# EAGLE board light_controller (EAGLE 8.5.0)
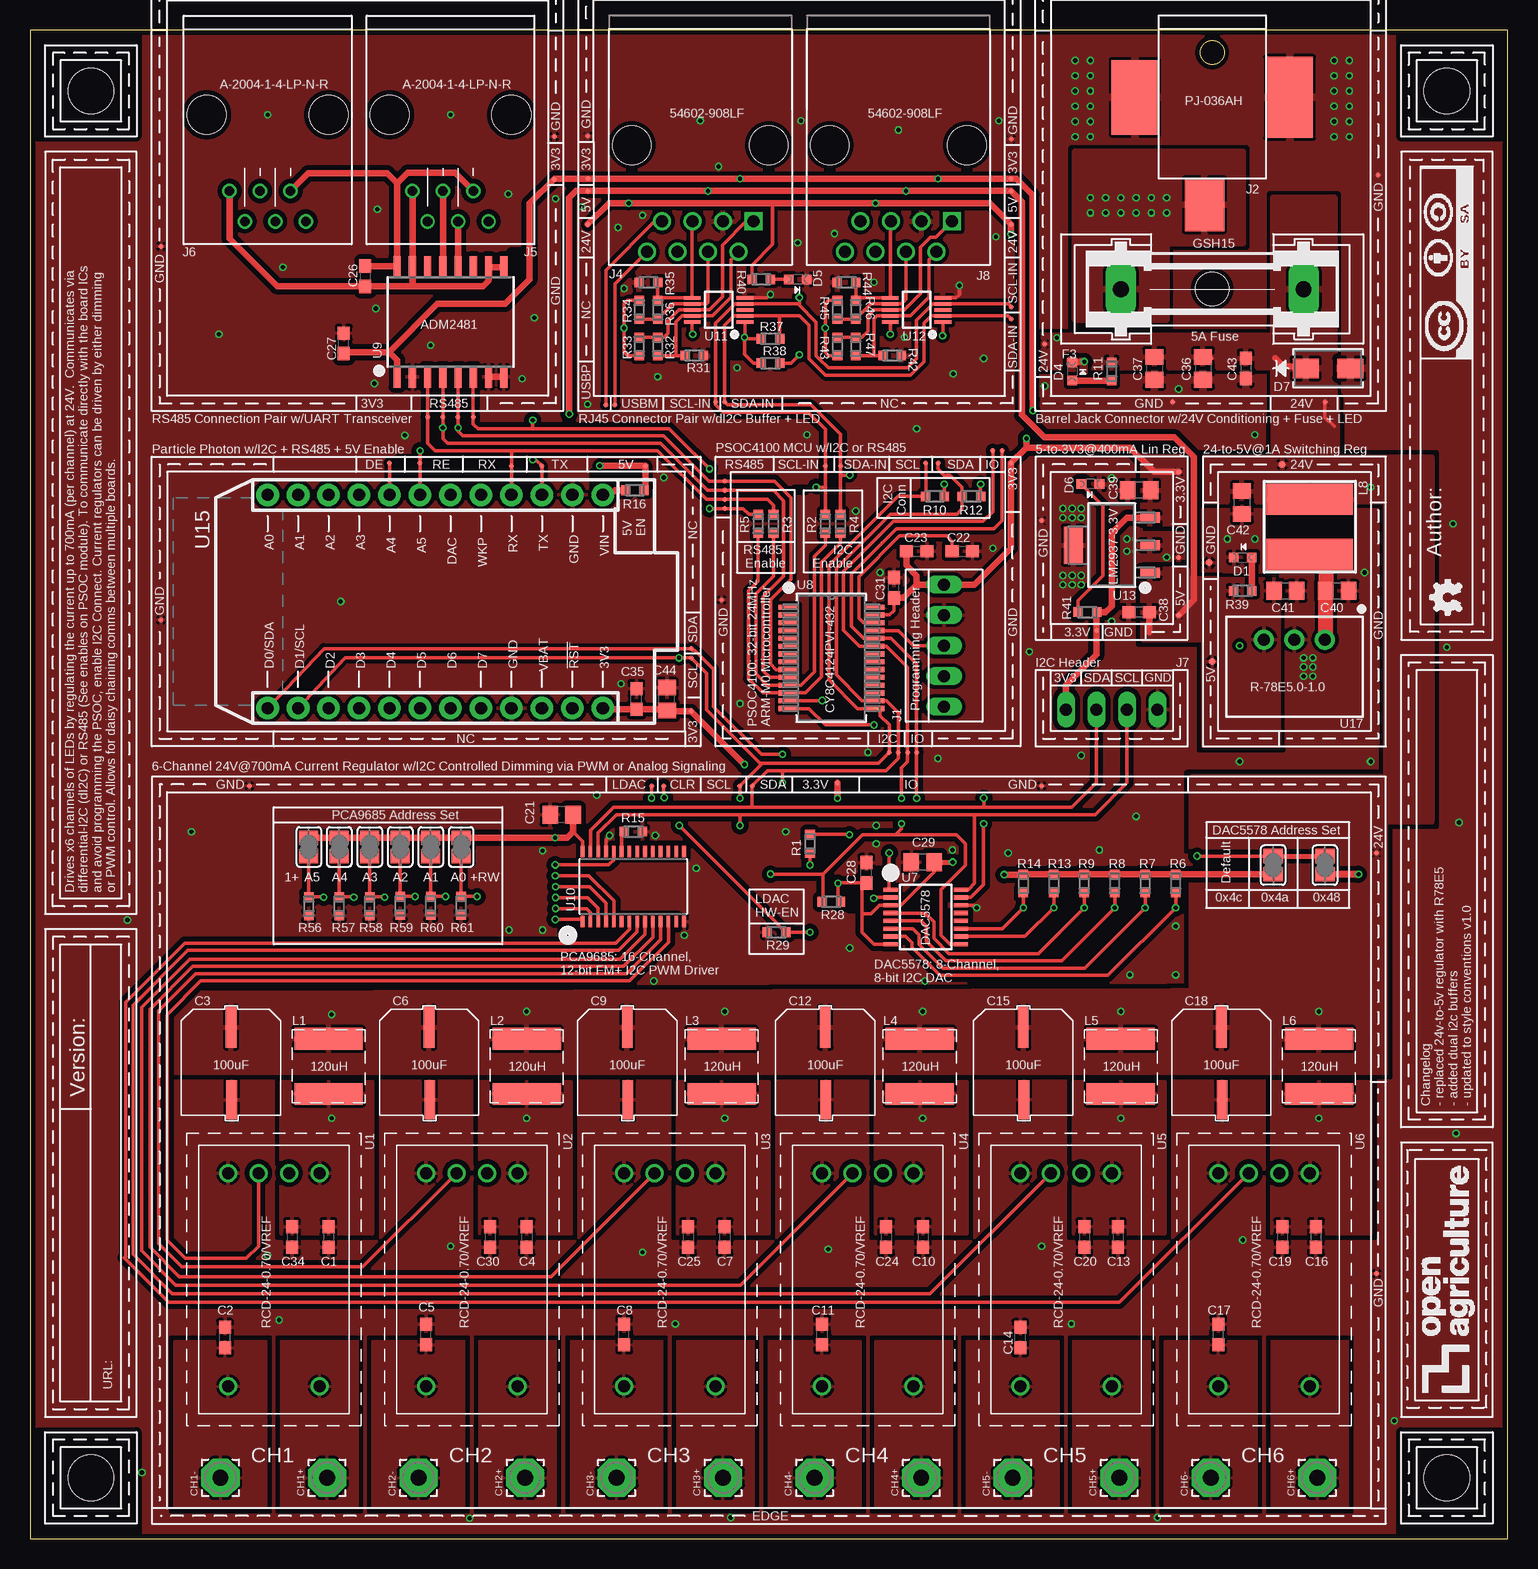
[diagram p2: board, top side]
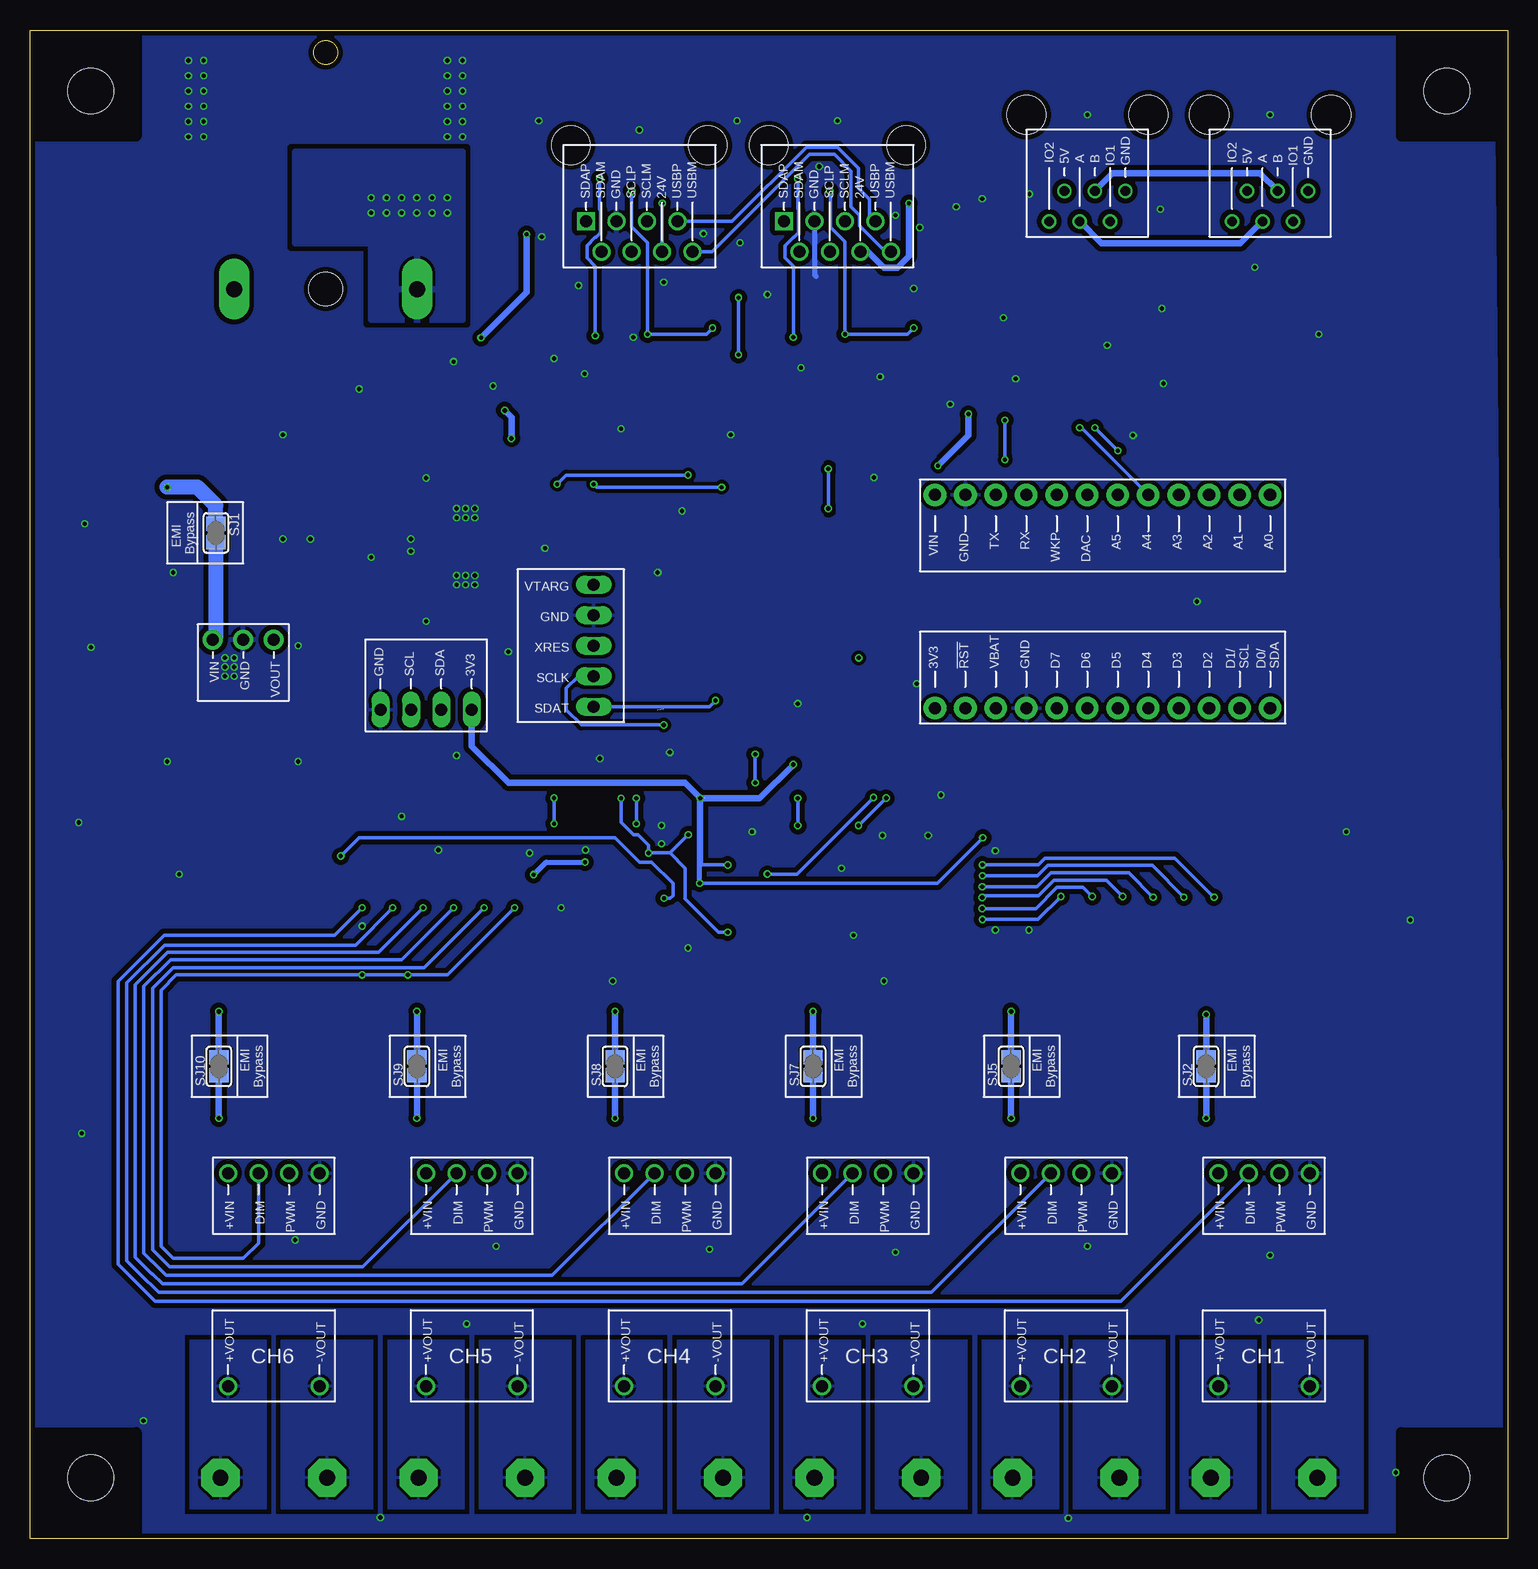
[diagram p3: board, bottom side, seen from below]

Size 123.19 x 125.73 mm. Coordinates in mm from the lower left corner, seen from the top.
Outline: 0,0 123.19,0 123.19,125.73 0,125.73 0,0
Copper layers (1*16): Top 0.035559375mm / dielectric 1.6mm / Bottom 0.035559375mm
Design rules "openag-router": minimum track width 6mil, minimum drill 10mil, track to track 12mil, track to pad 12mil, pad to pad 12mil, via to via 12mil, smd to smd 12mil, copper to edge 15mil, drill to drill 6mil, minimum pad ring 5mil, minimum via ring 5mil, stop-mask expansion 2.5mil, vias tented up to drill 20mil, thermal gap 10mil
tRestrict: 10 lines

## Footprints (pad centres in the part's own frame; a part is rotated, then mirrored left to right if it is on the bottom)
C0603 = smd 1.1 x 1: 1 -0.85,0; 2 0.85,0
EEE-1HA101UP = smd 0.889 x 3.404: + 0,-3.251 | smd 0.889 x 3.251: - -0.051,2.794
C0805 = smd 1.3 x 1.5: 1 -0.95,0; 2 0.95,0
3,17/1,3 = drill 1.321 pad 3.175 octagon: 1 0,0
CHIPLED_0603 = smd 0.8 x 0.8: A 0,-0.75; C 0,0.75
SMA = smd 2.18 x 1.63: 1 -1.857,0; 2 1.857,0
GSH15 = drill 1.321 pad 2.54 long: 1 -7.62,0; 2 7.62,0 | hole 2.794: 0,0
PSOC-PROGRAMMER-22-23-2051 = drill 1 long: 1 -5.08,0; 2 -2.54,0; 3 0,0; 4 2.54,0; 5 5.08,0
BARREL-JACK-PJ-036AH = smd 4.4 x 3.3: 1 2.2,-0.65 | smd 6.75 x 3.9: 2 -6.75,6.45 | smd 6.2 x 3.9: 3 -6.75,-6.45
RJ45-DI2C-USB-54602-908LF = drill 1: 24V(6) 1.905,8.89; DSCLM(5) 0.635,6.35; DSCLP(4) -0.635,8.89; DSDAM(2) -3.175,8.89; GND(3) -1.905,6.35; USBM(8) 4.445,8.89; USBP(7) 3.175,6.35 | drill 1 square: DSDAP(1) -4.445,6.35 | hole 3.2: -5.715,0; 5.715,0
RJ12-RS485--A-2004-1-4-LP-N-R = drill 0.8: 1 -8.89,-3.175; 2 -6.35,-1.905; 3 -8.89,-0.635; 4 -6.35,0.635; 5 -8.89,1.905; 6 -6.35,3.175 | hole 3.25: 0,-5.08; 0,5.08
HEADER-I2C = drill 1 long: 3V3 3.81,0.762; GND -3.81,0.762; SCL -1.27,0.762; SDA 1.27,0.762
74404064121 = smd 1.8 x 5.7: 1 -2.3,0; 2 2.3,0
29333C = smd 2.6 x 7.2: 1 -2.3,0; 2 2.3,0
RC0603N = smd 0.756 x 0.8: 1 -0.778,0; 2 0.778,0
EMI-BYPASS = smd 1.168 x 1.6: 1 -0.762,0.254; 2 0.762,0.254
SJ1 = smd 1.168 x 1.6: 1 -0.762,0; 2 0.762,0
TP04R = smd 0.4 x 0.4: 1 0,0
TP06R = smd 0.6 x 0.6: TP 0,0
RCD-24-PINNED = drill 1: 1 0,0; 2 0,-2.54; 3 0,-5.08; 4 0,-7.62; 5 17.78,-7.62; 6 17.78,0
TSSOP16 = smd 0.35 x 1.2: 1 -2.275,-2.925; 2 -1.625,-2.925; 3 -0.975,-2.925; 4 -0.325,-2.925; 5 0.325,-2.925; 6 0.975,-2.925; 7 1.625,-2.925; 8 2.275,-2.925; 9 2.275,2.925; 10 1.625,2.925; 11 0.975,2.925; 12 0.325,2.925; 13 -0.325,2.925; 14 -0.975,2.925; 15 -1.625,2.925; 16 -2.275,2.925
SSOP-28 = smd 1.651 x 0.432: 1 -3.581,4.225; 2 -3.581,3.575; 3 -3.581,2.925; 4 -3.581,2.275; 5 -3.581,1.625; 6 -3.581,0.975; 7 -3.581,0.325; 8 -3.581,-0.325; 9 -3.581,-0.975; 10 -3.581,-1.625; 11 -3.581,-2.275; 12 -3.581,-2.925; 13 -3.581,-3.575; 14 -3.581,-4.225; 15 3.581,-4.225; 16 3.581,-3.575; 17 3.581,-2.925; 18 3.581,-2.275; 19 3.581,-1.625; 20 3.581,-0.975; 21 3.581,-0.325; 22 3.581,0.325; 23 3.581,0.975; 24 3.581,1.625; 25 3.581,2.275; 26 3.581,2.925; 27 3.581,3.575; 28 3.581,4.225
SOIC16LWB = smd 0.6 x 1.8: 1 -4.445,-4.575; 2 -3.175,-4.575; 3 -1.905,-4.575; 4 -0.635,-4.575; 5 0.635,-4.575; 6 1.905,-4.575; 7 3.175,-4.575; 8 4.445,-4.575; 9 4.445,4.575; 10 3.175,4.575; 11 1.905,4.575; 12 0.635,4.575; 13 -0.635,4.575; 14 -1.905,4.575; 15 -3.175,4.575; 16 -4.445,4.575
TSSOP28 = smd 0.305 x 0.991: 1 -4.225,-2.918; 2 -3.575,-2.918; 3 -2.925,-2.918; 4 -2.275,-2.918; 5 -1.625,-2.918; 6 -0.975,-2.918; 7 -0.325,-2.918; 8 0.325,-2.918; 9 0.975,-2.918; 10 1.625,-2.918; 11 2.275,-2.918; 12 2.925,-2.918; 13 3.575,-2.918; 14 4.225,-2.918; 15 4.225,2.918; 16 3.575,2.918; 17 2.925,2.918; 18 2.275,2.918; 19 1.625,2.918; 20 0.975,2.918; 21 0.325,2.918; 22 -0.325,2.918; 23 -0.975,2.918; 24 -1.625,2.918; 25 -2.275,2.918; 26 -2.925,2.918; 27 -3.575,2.918; 28 -4.225,2.918
SOP50P490X110-10N = smd 1.4 x 0.3: 1 -2.2,1; 2 -2.2,0.5; 3 -2.2,0; 4 -2.2,-0.5; 5 -2.2,-1; 6 2.2,-1; 7 2.2,-0.5; 8 2.2,0; 9 2.2,0.5; 10 2.2,1
MP04A = smd 1.6 x 0.838: 1 -3.2,2.3; 2 -3.2,0; 3 -3.2,-2.3 | smd 1.6 x 3.099: 4 3.2,0
PHOTON = drill 1.016 pad 1.88: 1 1.27,32.258; 2 1.27,29.718; 3 1.27,27.178; 4 1.27,24.638; 5 1.27,22.098; 6 1.27,19.558; 7 1.27,17.018; 8 1.27,14.478; 9 1.27,11.938; 10 1.27,9.398; 11 1.27,6.858; 12 1.27,4.318; 13 19.05,4.318; 14 19.05,6.858; 15 19.05,9.398; 16 19.05,11.938; 17 19.05,14.478; 18 19.05,17.018; 19 19.05,19.558; 20 19.05,22.098; 21 19.05,24.638; 22 19.05,27.178; 23 19.05,29.718; 24 19.05,32.258
R-78E5.0-1.0 = drill 1 pad 1.676: 1 -2.54,0; 2 0,0; 3 2.54,0
CORNER = hole 3.81: 0,0

## Placement (x,y rotation side)
C1  10nF  [C0603]  24.89,25.15 270 top
C2  10nF  [C0603]  16.26,16.76 90 top
C3  100uF  [EEE-1HA101UP]  16.76,39.37 180 top
C4  10nF  [C0603]  41.4,25.15 270 top
C5  10nF  [C0603]  33.02,17.02 90 top
C6  100uF  [EEE-1HA101UP]  33.27,39.37 180 top
C7  10nF  [C0603]  57.91,25.15 270 top
C8  10nF  [C0603]  49.53,17.02 90 top
C9  100uF  [EEE-1HA101UP]  49.78,39.37 180 top
C10  10nF  [C0603]  74.42,25.15 270 top
C11  10nF  [C0603]  66.04,17.02 90 top
C12  100uF  [EEE-1HA101UP]  66.29,39.37 180 top
C13  10nF  [C0603]  90.68,25.15 270 top
C14  10nF  [C0603]  82.55,16.76 90 top
C15  100uF  [EEE-1HA101UP]  82.8,39.37 180 top
C16  10nF  [C0603]  107.19,25.15 270 top
C17  10nF  [C0603]  99.06,17.02 90 top
C18  100uF  [EEE-1HA101UP]  99.31,39.37 180 top
C19  2.2uF  [C0603]  104.39,25.15 270 top
C20  2.2uF  [C0603]  87.88,25.15 270 top
C21  10uF  [C0805]  44.32,60.33 180 top
C22  1uF  [C0603]  77.72,82.3 0 top
C23  1uF  [C0603]  73.91,82.3 0 top
C24  2.2uF  [C0603]  71.37,25.15 270 top
C25  2.2uF  [C0603]  54.86,25.15 270 top
C26  0.1uF  [C0603]  27.94,105.21 270 top
C27  0.1uF  [C0603]  26.16,99.62 90 top
C28  0.1uF  [C0603]  69.72,55.5 90 top
C29  4.7uF  [C0805]  74.42,56.39 180 top
C30  2.2uF  [C0603]  38.35,25.15 270 top
C31  0.1uF  [C0603]  72.01,79.25 90 top
C34  2.2uF  [C0603]  21.84,25.15 270 top
C35  0.1uF  [C0603]  50.55,69.98 90 top
C36  10uF  [C0805]  97.79,97.54 270 top
C37  4.7uF  [C0805]  93.73,97.54 270 top
C38  0.1uF  [C0603]  92.46,77.22 180 top
C39  10uF  [C0805]  92.46,87.38 180 top
C40  10uF  [C0805]  108.97,78.99 0 top
C41  10uF  [C0805]  104.65,78.99 0 top
C42  10uF  [C0805]  101.03,86.36 270 top
C43  0.1uF  [C0603]  101.35,97.54 270 top
C44  4.7uF  [C0805]  53.09,69.98 90 top
CH1+  [3,17/1,3]  24.77,5.08 90 top
CH1-  [3,17/1,3]  15.88,5.08 90 top
CH2+  [3,17/1,3]  41.27,5.08 90 top
CH2-  [3,17/1,3]  32.38,5.08 90 top
CH3+  [3,17/1,3]  57.78,5.08 90 top
CH3-  [3,17/1,3]  48.9,5.08 90 top
CH4+  [3,17/1,3]  74.3,5.08 90 top
CH4-  [3,17/1,3]  65.41,5.08 90 top
CH5+  [3,17/1,3]  90.81,5.08 90 top
CH5-  [3,17/1,3]  81.92,5.08 90 top
CH6+  [3,17/1,3]  107.31,5.08 90 top
CH6-  [3,17/1,3]  98.42,5.08 90 top
D1  APT1608  [CHIPLED_0603]  101.09,81.79 90 top
D4  APT1608  [CHIPLED_0603]  86.87,97.28 0 top
D5  APT1608  [CHIPLED_0603]  64.01,104.95 270 top
D6  APT1608  [CHIPLED_0603]  88.39,87.88 270 top
D7  SMAJ26A  [SMA]  108.2,97.54 0 top
F3  GSH15  [GSH15]  98.55,104.14 0 top
J1  0022232051  [PSOC-PROGRAMMER-22-23-2051]  76.2,74.42 90 top
J2  PJ-036AH  [BARREL-JACK-PJ-036AH]  98.55,113.36 270 top
J4  54602-908LF  [RJ45-DI2C-USB-54602-908LF]  55.88,116.13 180 top
J5  A-2004-1-4-LP-N-R  [RJ12-RS485--A-2004-1-4-LP-N-R]  35.05,118.67 90 top
J6  A-2004-1-4-LP-N-R  [RJ12-RS485--A-2004-1-4-LP-N-R]  19.81,118.67 90 top
J7  I2C-HEADER  [HEADER-I2C]  90.17,69.85 180 top
J8  54602-908LF  [RJ45-DI2C-USB-54602-908LF]  72.39,116.13 180 top
L1  120uH  [74404064121]  24.89,39.37 270 top
L2  120uH  [74404064121]  41.4,39.37 270 top
L3  120uH  [74404064121]  57.66,39.37 270 top
L4  120uH  [74404064121]  74.17,39.37 270 top
L5  120uH  [74404064121]  90.93,39.37 270 top
L6  120uH  [74404064121]  107.44,39.37 270 top
L8  33uH  [29333C]  106.68,84.33 270 top
R1  1K  [RC0603N]  65.02,57.91 90 top
R2  0 OHM  [RC0603N]  66.29,84.58 90 top
R3  0 OHM  [RC0603N]  61.98,84.58 90 top
R4  0 OHM  [RC0603N]  67.56,84.58 90 top
R5  0 OHM  [RC0603N]  60.71,84.58 90 top
R6  1K  [RC0603N]  95.5,54.61 90 top
R7  1K  [RC0603N]  92.96,54.61 90 top
R8  1K  [RC0603N]  90.42,54.61 90 top
R9  1K  [RC0603N]  87.88,54.61 90 top
R10  0 OHM  [RC0603N]  75.44,86.87 180 top
R11  100  [RC0603N]  90.17,97.28 90 top
R12  0 OHM  [RC0603N]  78.49,86.87 180 top
R13  1K  [RC0603N]  85.34,54.61 90 top
R14  1K  [RC0603N]  82.8,54.61 90 top
R15  1K  [RC0603N]  50.29,58.93 0 top
R16  0 OHM  [RC0603N]  50.42,87.38 180 top
R28  1K  [RC0603N]  66.8,53.09 180 top
R29  0 OHM  [RC0603N]  62.23,50.55 0 top
R31  600  [RC0603N]  55.37,98.6 0 top
R32  120  [RC0603N]  52.32,99.36 270 top
R33  600  [RC0603N]  50.8,99.36 90 top
R34  600  [RC0603N]  50.8,102.41 90 top
R35  600  [RC0603N]  51.56,104.7 0 top
R36  120  [RC0603N]  52.32,102.41 270 top
R37  10K  [RC0603N]  61.72,100 180 top
R38  10K  [RC0603N]  61.72,97.97 180 top
R39  100  [RC0603N]  101.09,78.99 180 top
R40  1K  [RC0603N]  60.96,104.95 180 top
R41  100  [RC0603N]  88.14,77.22 0 top
R42  600  [RC0603N]  71.88,98.6 0 top
R43  600  [RC0603N]  67.31,99.36 90 top
R44  600  [RC0603N]  68.07,104.7 0 top
R45  600  [RC0603N]  67.31,102.41 90 top
R46  120  [RC0603N]  68.83,102.41 270 top
R47  120  [RC0603N]  68.83,99.36 270 top
R56  1K  [RC0603N]  23.24,52.71 90 top
R57  1K  [RC0603N]  25.78,52.71 90 top
R58  1K  [RC0603N]  28.32,52.71 90 top
R59  1K  [RC0603N]  30.86,52.75 90 top
R60  1K  [RC0603N]  33.4,52.75 90 top
R61  1K  [RC0603N]  35.94,52.75 90 top
SJ1  [EMI-BYPASS]  107.95,83.82 270 bottom
SJ2  [EMI-BYPASS]  24.89,39.37 90 bottom
SJ5  [EMI-BYPASS]  41.15,39.37 90 bottom
SJ7  [EMI-BYPASS]  57.66,39.37 90 bottom
SJ8  [EMI-BYPASS]  74.17,39.37 90 bottom
SJ9  [EMI-BYPASS]  90.68,39.37 90 bottom
SJ10  [EMI-BYPASS]  107.19,39.37 90 bottom
SJ_A0  [SJ1]  35.94,57.65 270 top
SJ_A1  [SJ1]  33.4,57.65 270 top
SJ_A2  [SJ1]  30.86,57.65 270 top
SJ_A3  [SJ1]  28.32,57.65 270 top
SJ_A4  [SJ1]  25.78,57.65 270 top
SJ_A5  [SJ1]  23.24,57.65 270 top
SJ_A16  [SJ1]  103.63,56.13 90 top
SJ_A17  [SJ1]  107.95,56.13 90 top
TP1  TPTP04R  [TP04R]  107.95,94.74 0 top
TP2  TPTP04R  [TP04R]  95.25,94.74 0 top
TP3  TPTP04R  [TP04R]  32.51,89.66 0 top
TP4  TPTP04R  [TP04R]  29.97,89.66 0 top
TP5  TPTP04R  [TP04R]  72.39,65.53 90 top
TP6  TPTP04R  [TP04R]  71.63,65.53 90 top
TP7  TPTP04R  [TP04R]  10.92,107.7 0 top
TP8  TPTP04R  [TP04R]  81.03,90.68 90 top
TP9  TPTP04R  [TP04R]  57.66,78.23 90 top
TP10  TPTP04R  [TP04R]  43.69,116.84 0 top
TP11  TPTP04R  [TP04R]  57.91,85.85 90 top
TP12  TPTP04R  [TP04R]  112.27,57.15 90 top
TP13  TPTP04R  [TP04R]  67.31,62.99 90 top
TP14  TPTP04R  [TP04R]  18.29,62.74 90 top
TP15  TPTP04R  [TP04R]  60.2,62.74 90 top
TP16  TPTP04R  [TP04R]  59.18,62.74 90 top
TP17  TPTP04R  [TP04R]  51.82,62.74 90 top
TP18  TPTP04R  [TP04R]  75.69,89.66 90 top
TP19  TPTP04R  [TP04R]  81.79,89.66 90 top
TP20  TPTP04R  [TP04R]  57.91,86.61 90 top
TP21  TPTP04R  [TP04R]  57.91,87.38 90 top
TP22  TPTP04R  [TP04R]  57.91,88.14 90 top
TP23  TPTP04R  [TP04R]  80.26,90.68 90 top
TP24  TPTP04R  [TP04R]  74.68,89.66 90 top
TP25  TPTP04R  [TP04R]  67.56,89.41 90 top
TP26  TPTP04R  [TP04R]  66.29,89.41 90 top
TP27  TPTP04R  [TP04R]  43.69,113.28 0 top
TP28  TPTP04R  [TP04R]  36.96,93.47 270 top
TP29  TPTP04R  [TP04R]  33.15,93.47 270 top
TP30  TPTP04R  [TP04R]  34.42,93.47 270 top
TP31  TPTP04R  [TP04R]  35.69,93.47 270 top
TP32  TPTP04R  [TP04R]  52.83,62.74 90 top
TP33  TPTP04R  [TP04R]  84.33,62.74 0 top
TP34  TPTP04R  [TP04R]  112.27,22.1 0 top
TP35  TPTP04R  [TP04R]  112.39,113.67 0 top
TP36  TPTP04R  [TP04R]  84.58,99.57 0 top
TP37  TPTP04R  [TP04R]  73.15,65.53 90 top
TP38  TPTP04R  [TP04R]  73.91,65.53 90 top
TP40  TPTP04R  [TP04R]  46.48,113.33 270 top
TP41  TPTP04R  [TP04R]  46.48,112.32 270 top
TP42  TPTP04R  [TP04R]  46.48,116.89 270 top
TP43  TPTP04R  [TP04R]  46.48,109.52 270 top
TP44  TPTP04R  [TP04R]  57.91,94.74 270 top
TP45  TPTP04R  [TP04R]  57.15,94.74 270 top
TP46  TPTP04R  [TP04R]  48.01,94.49 270 top
TP47  TPTP04R  [TP04R]  48.77,94.49 270 top
TP48  TPTP04R  [TP04R]  81.79,113.33 270 top
TP49  TPTP04R  [TP04R]  81.79,112.32 270 top
TP50  TPTP04R  [TP04R]  81.79,109.52 270 top
TP51  TPTP04R  [TP04R]  81.79,116.64 270 top
TP52  TPTP04R  [TP04R]  81.79,102.67 270 top
TP53  TPTP04R  [TP04R]  81.79,101.65 270 top
TP54  TPTP06R  [TP06R]  98.55,73.09 180 top
TP55  TPTP06R  [TP06R]  104.39,89.53 180 top
TP56  TPTP06R  [TP06R]  98.3,81.34 180 top
TP57  TPTP04R  [TP04R]  88.9,75.69 90 top
TP58  TPTP04R  [TP04R]  95.76,76.96 90 top
TP59  TPTP04R  [TP04R]  84.33,84.84 90 top
TP60  TPTP04R  [TP04R]  95.76,88.9 90 top
TP61  TPTP04R  [TP04R]  95.76,81.79 90 top
TP66  TPTP04R  [TP04R]  55.12,73.41 180 top
TP67  TPTP04R  [TP04R]  55.12,68.96 180 top
TP68  TPTP04R  [TP04R]  10.92,76.58 180 top
TP69  TPTP04R  [TP04R]  55.12,74.17 180 top
TP70  TPTP04R  [TP04R]  51.31,89.41 0 top
TP71  TPTP04R  [TP04R]  42.67,89.41 0 top
TP72  TPTP04R  [TP04R]  40.13,89.41 0 top
U1  RCD-24-0.70/VREF  [RCD-24-PINNED]  24.13,30.48 270 top
U2  RCD-24-0.70/VREF  [RCD-24-PINNED]  40.64,30.48 270 top
U3  RCD-24-0.70/VREF  [RCD-24-PINNED]  57.15,30.48 270 top
U4  RCD-24-0.70/VREF  [RCD-24-PINNED]  73.66,30.48 270 top
U5  RCD-24-0.70/VREF  [RCD-24-PINNED]  90.17,30.48 270 top
U6  RCD-24-0.70/VREF  [RCD-24-PINNED]  106.68,30.48 270 top
U7  DAC5578  [TSSOP16]  74.68,51.82 270 top
U8  CY8C4124PVI-432  [SSOP-28]  66.8,73.41 0 top
U9  ADM2481  [SOIC16LWB]  35.05,101.4 0 top
U10  PCA9685  [TSSOP28]  50.29,54.36 0 top
U11  PCA9615  [SOP50P490X110-10N]  57.4,102.41 180 top
U12  PCA9615  [SOP50P490X110-10N]  73.91,102.41 180 top
U13  LM2937-3.3V  [MP04A]  90.17,82.8 180 top
U15  PHOTONH  [PHOTON]  15.49,88.27 270 top
U17  R-78E5.0-1.0  [R-78E5.0-1.0]  105.41,74.93 180 top
U$1  [CORNER]  5.08,5.08 0 top
U$2  [CORNER]  118.11,5.08 90 top
U$3  [CORNER]  5.08,120.65 270 top
U$4  [CORNER]  118.11,120.65 180 top
U$6  AUTHOR  [AUTHOR]  121.92,74.93 90 top
U$7  TITLE  [TITLE]  8.89,10.16 90 top
U$8  [LOGO]  121.92,10.16 90 top

## Tracks (layer width: path | path; a pad name or v marks a point on that pad's centre or on a via)
24V_EMI
  Top 1.27: U17.1 108.02,75 C40.1 108.02,80.69 arc90 L8.2
  Bottom 1.27: SJ1.2 107.7,75.18 U17.1
24V_IN  (via drill 0.35)
  other vias: 94.74,111.76 94.74,110.49 93.47,111.76 93.47,110.49 92.2,111.76 92.2,110.49 90.93,111.76 89.66,111.76 89.66,110.49 90.93,110.49 88.39,110.49 88.39,111.76
  pour Bottom (isolate 0.406): 94.74,101.6 87.12,101.6 87.12,115.57 101.09,115.57 101.09,107.95 94.74,107.95
  pour Top (isolate 0.406): 87.12,101.6 94.74,101.6 94.74,107.95 101.09,107.95 101.09,115.57 87.12,115.57
485_5V
  Top 0.559: J5.2 35.43,113.84 31.5,113.84 30.61,112.95 | 30.61,112.95 U9.16 30.52,106.06 C26.1 | 30.61,112.95 29.77,113.79 23.19,113.79 J6.2
485_A
  Top 0.559: U9.12 J5.3
  Bottom 0.559: J5.3 33.86,107.95 22.28,107.95 J6.3
485_B
  Top 0.305: 34.54,112.19 J5.4
  Top 0.559: U9.13 J5.4
  Bottom 0.559: J5.4 32.94,113.79 20.65,113.79 J6.4
485_GND
  Top 0.559: U9.9 U9.10 38.23,104.83 37.76,104.36 31.75,104.36 | 31.75,104.36 31.88,104.48 U9.15 J5.6 | 28.07,104.48 C26.2 | C26.2 31.75,104.36 | C26.2 20.61,104.36 16.64,108.33 J6.6
!LDAC!  (via drill 0.35)
  Top 0.305: v71.63,57.15 71.62,56.38 71.62,54.22 U7.1 | 62.39,51.16 62.39,51.18 62.37,51.2 | 62.37,51.2 v54.13,59.44 | 68.91,80.85 | v68.32,58.68 v68.31,58.69 R1.2 | v51.82,61.72 TP17.1 | 62.37,51.2 62.37,51.18 R29.2 v65.02,50.55 | 68.91,80.85 68.48,80.42 68.48,76.03 69.47,75.03 U8.24 71.78,75.03 73.91,72.9 TP38.1 73.86,65.48 73.91,65.43 v73.91,61.72 73.86,61.77 | 71.04,82.98 | 68.91,80.85 71.04,82.98 | 71.04,82.98 72.24,84.18 80.37,84.18 81.03,84.84 TP8.1
  Bottom 0.305: v65.02,50.55 65.79,50.55 68.58,53.34 68.58,55.88 69.85,57.15 | v68.32,58.68 69.85,57.15 | 69.85,57.15 v71.63,57.15 71.63,57.79 72.51,58.67 72.89,58.67 73.91,59.69 v73.91,61.72 | v54.13,59.44 51.84,61.72 v51.82,61.72
+3V3  (via drill 0.35)
  Top 0.305: v67.36,54.63 67.36,53.3 R28.1 | R1.1 v65.02,56.15 | 69.34,52.07 69.34,50.55 70.35,49.54 U7.8 | 69.34,52.07 70.1,52.07 70.83,52.79 U7.3 72.6,52.79 75.37,55.56 C29.1 | v59.56,100.13 59.69,100 R37.2 | v76.07,100.25 76.11,100.3 U12.1 | v59.56,100.13 59.56,98.73 60.33,97.97 R38.2 | U10.28 46.07,58.12 45.27,58.92 | U11.1 59.6,100.17 v59.56,100.13 | 69.34,52.07 69.34,54.27 C28.1 67.37,54.65 | U8.27 71.65,76.98 72.01,77.34 C31.1
  Top 0.356: 67.37,54.65 v67.36,54.63
  Top 0.406: 23.21,58.45 SJ_A5.1 | v43.76,58.41 v43.76,58.42 | 103.63,55.39 SJ_A16.1 | 36.07,58.54 SJ_A0.1 | C29.1 v76.91,56.39
  Top 0.559: SJ_A5.1 SJ_A4.1 SJ_A3.1 SJ_A2.1 SJ_A1.1 SJ_A0.1 v43.76,58.42 44.77,58.42 45.27,58.92 C21.1 | U9.1 30.61,98.22 29.93,98.9 | 103.62,55.39 SJ_A16.1 95.52,55.37 R6.2 R7.2 R8.2 R9.2 R13.2 R14.2 82.76,55.35 v81.2,55.35 | 29.93,98.9 26.29,98.9 C27.1 | U13.3 91.45,85.1 90.17,83.82 90.17,77.72 89.66,77.22 R41.2 88.9,77.2 TP57.1 88.9,73.66 86.36,71.12 J7.3V3 | 29.93,98.9 33.96,102.92 39.62,102.92 41.66,104.95 41.66,111.3 TP27.1 43.74,113.33 TP40.1 v59.18,113.33 v75.69,113.33 TP48.1 82.25,113.33 83.57,112.01 83.57,95 83.61,94.95 v83.61,94.02 | 50.65,69.03 C35.1 | C35.1 47.59,69.13 U15.24 | C35.1 53.24,69.13 C44.1 53.15,68.96 TP67.1 v59.56,64.52 | C31.1 72.81,78.4 73.91,79.5 | 73.91,79.5 J1.5 78.74,79.5 81.79,82.55 TP19.1 83.06,90.93 | C23.1 73.06,81.11 73.91,80.26 73.91,79.5 | TP60.1 93.73,88.9 91.69,90.93 83.06,90.93 | 83.06,90.93 v83.06,91.69 | v67.31,61.72 TP13.1
  Bottom 0.305: v43.76,58.42 47.55,54.63 v67.36,54.63 | v65.02,56.15 67.34,56.15 67.36,56.13 | v59.56,100.13 59.56,106.04 60.26,106.74 60.26,107.74 59.55,108.45 59.51,108.45 59.12,108.84 59.12,110.72 59.18,110.78 v59.18,113.33 | v75.69,113.33 75.69,110.78 75.63,110.72 75.63,108.84 76.02,108.45 76.06,108.45 76.77,107.74 76.77,106.74 76.07,106.04 v76.07,100.25
  Bottom 0.406: v67.36,54.63 67.36,56.13 | v76.91,56.39 80.16,56.39 v81.2,55.35
  Bottom 0.559: 67.34,56.15 67.34,61.43 v67.31,61.72 | J7.3V3 86.36,66.04 83.31,62.99 68.58,62.99 v67.31,61.72 | v83.06,91.69 83.06,93.47 v83.61,94.02 | v67.31,61.72 62.36,61.72 v59.56,64.52
  pour Top (isolate 0.305): 96.52,90.17 92.71,90.17 92.71,84.58 96.52,84.58
+5V  (via drill 0.35)
  Top 0.305: v71.7,100.38 71.71,100.39 U12.10 | R45.2 66.56,103.19 66.29,102.92 v66.29,100.89 66.29,98.86 66.56,98.59 R43.1 | v55.24,100.38 55.2,100.42 U11.10 | R34.2 49.8,103.19 49.53,102.92 v49.53,100.89 49.53,98.86 49.8,98.59 R33.1
  Top 0.559: 93.31,75.53 C38.1 | R16.1 51.31,87.49 TP70.1 v47.5,89.41 | v44.96,93.73 44.96,111.76 45.52,112.32 TP41.1 v56.52,112.32 v73.03,112.32 TP49.1 82.7,111.4 82.7,93.67 84.58,91.8 95.4,91.8 97.03,90.17 97.03,78.23 TP58.1
  Bottom 0.305: v66.29,100.89 66.8,100.38 v71.7,100.38 71.7,108.02 73.03,109.34 v73.03,112.32 | v56.52,112.32 56.45,112.26 56.45,109.28 55.24,108.07 v55.24,100.38 50.04,100.38 v49.53,100.89
  Bottom 0.559: v44.96,93.73 44.96,91.95 v47.5,89.41
  pour Top (isolate 0.305): 97.79,66.04 97.79,80.01 104.14,80.01 104.14,66.04
  pour Top (isolate 0.305): 96.52,74.93 96.52,80.77 92.71,80.77 92.71,74.93
  pour Top (isolate 0.406): 99.06,80.01 95.25,80.01 95.25,74.93 99.06,74.93
+24V  (via drill 0.35)
  Top 0.305: 53.98,111.18 53.85,111.3 | 61.91,111.3 61.91,107.87 60.18,106.14 R40.2 | TP1.1 107.95,93.47 108.71,92.71
  Top 0.559: TP43.1 48.26,111.3 v49.91,111.3 53.85,111.3 61.91,111.3 v70.48,111.3 80.01,111.3 TP50.1 v81.79,108.71 | 98.4,98.39 C36.1 | 90.19,98.04 R11.2 | D7.1 104.39,97.79 103.8,98.39
  Bottom 0.305: J8.24V(6) v70.48,111.3
  Bottom 0.559: 24.64,40.39 SJ2.2 v25.15,43.69 | SJ10.2 v107.44,43.94 | SJ9.2 v90.93,43.94 | v74.42,43.94 SJ8.2 | v57.91,43.94 SJ7.2 | v41.4,43.94 SJ5.2 | v49.91,111.3 49.91,106.87 50.88,105.91 51.99,105.91 53.32,107.24 J4.24V(6) | v81.79,108.71 81.79,103.89 v85.6,100.08
  Bottom 1.27: SJ1.1 107.7,86.11 109.22,87.63 v111.76,87.63
  pour Top (isolate 0.406): 111.76,38.86 111.76,45.72 12.06,45.47 12.06,38.86
  pour Top (isolate 0.406): 96.77,63.5 96.77,38.86 113.03,38.86 113.03,63.5
  pour Top (isolate 0.406): 97.79,86.36 97.79,90.17 113.03,90.17 113.03,86.36
  pour Top (isolate 0.406): 108.71,93.98 108.71,111.76 103.63,111.76 103.63,93.98
  pour Top (isolate 0.406): 104.14,100.33 104.14,97.54 83.82,97.54 83.82,100.33
  pour Top (isolate 0.406): 103.63,95 108.97,95 108.97,89.15 103.63,89.15
  pour Top (isolate 0.406): 111.76,90.17 116.84,90.17 116.84,59.69 111.76,59.69 111.76,63.5 113.03,63.5 113.03,86.36 111.76,86.36
A0  (via drill 0.35)
  Top 0.305: SJ_A0.2 R61.2 v37.26,53.52 | v43.79,51.61 46.07,51.61 U10.1
  Bottom 0.305: v43.79,51.61 39.17,51.61 v37.26,53.52
A1  (via drill 0.35)
  Top 0.305: SJ_A1.2 R60.2 v34.64,53.52 v34.65,53.52 | v43.81,52.52 46.38,52.52 46.72,52.18 U10.2
  Bottom 0.305: v43.81,52.52 39.33,52.52 37.58,54.28 35.41,54.28 v34.65,53.52
A2  (via drill 0.35)
  Top 0.305: SJ_A2.2 R59.2 32.1,53.52 v32.11,53.52 | v43.81,53.43 46.47,53.43 47.37,52.53 U10.3
  Bottom 0.305: v43.81,53.43 43.66,53.58 39.13,53.58 37.83,54.89 33.47,54.89 v32.11,53.52
A3  (via drill 0.35)
  Top 0.305: SJ_A3.2 R58.2 29.54,53.49 v29.57,53.47 | v43.81,54.34 46.63,54.34 48.02,52.95 U10.4
  Bottom 0.305: v43.81,54.34 39.24,54.34 38.08,55.5 31.59,55.5 v29.57,53.47
A4  (via drill 0.35)
  Top 0.305: SJ_A4.2 R57.2 | R57.2 25.88,53.39 | R57.2 26.98,53.49 v27,53.47 | v43.79,55.25 46.58,55.25 48.67,53.16 U10.5
  Bottom 0.305: v43.79,55.25 39.19,55.25 38.33,56.11 29.64,56.11 v27,53.47
A5  (via drill 0.35)
  Top 0.254: 23.07,53.49 R56.2
  Top 0.305: SJ_A5.2 23.24,53.66 23.07,53.49 | 23.34,53.39 R56.2 24.46,53.49 v24.49,53.47 | v43.79,56.16 48.23,56.16 48.67,56.59 U10.24
  Bottom 0.305: v43.79,56.16 39.15,56.16 38.59,56.72 27.73,56.72 v24.49,53.47
ADDR0  (via drill 0.35)
  Top 0.305: v97.28,56.9 SJ_A16.2 | v70.33,53.37 70.4,53.44 U7.2
  Top 0.406: SJ_A16.2 SJ_A17.2
  Bottom 0.305: v70.33,53.37 69.82,53.37 69.6,53.59 69.6,54.61 71.38,56.39 72.37,56.39 74.4,58.42 95.76,58.42 v97.28,56.9
CH1+
  pour Bottom (isolate 0.406): 20.95,2.54 20.95,16.51 27.3,16.51 27.3,2.54
  pour Top (isolate 0.406): 20.95,2.54 20.95,16.51 27.3,16.51 27.3,2.54
CH1-
  pour Top (isolate 0.406): 12.06,2.54 12.06,16.51 19.68,16.51 19.68,2.54
  pour Bottom (isolate 0.406): 12.06,2.54 12.06,16.51 19.68,16.51 19.68,2.54
CH2+
  pour Bottom (isolate 0.406): 37.47,2.54 37.47,16.51 43.81,16.51 43.81,2.54
  pour Top (isolate 0.406): 37.47,2.54 37.47,16.51 43.81,16.51 43.81,2.54
CH2-
  pour Top (isolate 0.406): 28.57,2.54 28.57,16.51 36.2,16.51 36.2,2.54
  pour Bottom (isolate 0.406): 28.57,2.54 28.57,16.51 36.2,16.51 36.2,2.54
CH3+
  pour Bottom (isolate 0.406): 53.98,2.54 53.98,16.51 60.33,16.51 60.33,2.54
  pour Top (isolate 0.406): 53.98,2.54 53.98,16.51 60.33,16.51 60.33,2.54
CH3-
  pour Top (isolate 0.406): 45.09,2.54 45.09,16.51 52.7,16.51 52.7,2.54
  pour Bottom (isolate 0.406): 45.09,2.54 45.09,16.51 52.7,16.51 52.7,2.54
CH4+
  pour Bottom (isolate 0.406): 70.48,2.54 70.48,16.51 76.83,16.51 76.83,2.54
  pour Top (isolate 0.406): 70.48,2.54 70.48,16.51 76.83,16.51 76.83,2.54
CH4-
  pour Top (isolate 0.406): 61.59,2.54 61.59,16.51 69.22,16.51 69.22,2.54
  pour Bottom (isolate 0.406): 61.59,2.54 61.59,16.51 69.22,16.51 69.22,2.54
CH5+
  pour Bottom (isolate 0.406): 87,2.54 87,16.51 93.34,16.51 93.34,2.54
  pour Top (isolate 0.406): 87,2.54 87,16.51 93.34,16.51 93.34,2.54
CH5-
  pour Top (isolate 0.406): 78.11,2.54 78.11,16.51 85.72,16.51 85.72,2.54
  pour Bottom (isolate 0.406): 78.11,2.54 78.11,16.51 85.72,16.51 85.72,2.54
CH6+
  pour Bottom (isolate 0.406): 103.5,2.54 103.5,16.51 109.86,16.51 109.86,2.54
  pour Top (isolate 0.406): 103.5,2.54 103.5,16.51 109.86,16.51 109.86,2.54
CH6-
  pour Top (isolate 0.406): 94.61,2.54 94.61,16.51 102.23,16.51 102.23,2.54
  pour Bottom (isolate 0.406): 94.61,2.54 94.61,16.51 102.23,16.51 102.23,2.54
DAC_!CLR!  (via drill 0.35)
  Top 0.305: 66.11,55.4 v61.72,55.4 | 66.11,55.4 66.11,53.17 R28.2 | v52.88,61.77 52.83,61.81 TP32.1 | U7.9 76.7,49.54 75.95,50.3 75.95,54.1 77.98,56.13 77.98,57.91 77.22,58.67 72.14,58.67 | TP23.1 80.26,85.6 79.45,84.78 71.98,84.78 67.82,80.62 67.82,75.69 69.13,74.38 U8.23 71.42,74.38 73.15,72.64 TP37.1 73.15,64.77 72.64,64.26 v72.64,61.72 | 66.11,55.4 69.39,58.67 72.14,58.67 | 72.14,58.67 72.64,59.18 v72.64,59.59
  Bottom 0.305: 61.7,55.37 v61.72,55.4 59.24,55.4 v52.88,61.77 | v72.64,59.59 v72.64,61.72
DIM1  (via drill 0.35)
  Top 0.305: U7.7 73,50.19 73.51,49.68 73.51,49.29 75.86,46.94 89.86,46.94 v95.5,52.58 R6.1
  Bottom 0.305: v95.5,52.58 97.79,50.29 112.01,50.29 115.82,46.48 115.82,22.87 112.77,19.81 32.26,19.81 U1.2
DIM2  (via drill 0.35)
  Top 0.305: U7.6 73.62,50.84 74.12,50.34 74.12,49.54 76.11,47.55 87.94,47.55 v92.96,52.58 R7.1
  Bottom 0.305: v92.96,52.58 96.06,49.48 111.96,49.48 115.11,46.32 115.11,23.16 114.05,22.1 114.04,22.1 112.46,20.52 48.06,20.52 U2.2
DIM3  (via drill 0.35)
  Top 0.305: U7.5 74.29,51.49 74.73,51.05 74.73,49.79 76.36,48.16 86,48.16 v90.42,52.58 R8.1
  Bottom 0.305: v90.42,52.58 94.13,48.87 111.7,48.87 114.4,46.17 114.4,23.47 113.03,22.1 113.01,22.1 112.15,21.23 63.86,21.23 U3.2
DIM4  (via drill 0.35)
  Top 0.305: U7.4 74.61,52.14 75.34,51.41 75.34,50.05 76.61,48.77 84.07,48.77 v87.88,52.58 R9.1
  Bottom 0.305: v87.88,52.58 92.2,48.26 111.45,48.26 113.69,46.02 113.69,23.77 113.03,23.11 113.02,23.11 111.85,21.95 79.65,21.95 U4.2
DIM5  (via drill 0.35)
  Top 0.305: U7.10 82.96,50.19 v85.34,52.58 R13.1
  Bottom 0.305: v85.34,52.58 90.32,47.6 111.25,47.6 112.98,45.87 112.98,24.08 112.52,23.62 112.51,23.62 111.55,22.66 95.45,22.66 U5.2
DIM6  (via drill 0.35)
  Top 0.305: U7.11 81.07,50.84 v82.8,52.58 R14.1
  Bottom 0.305: v82.8,52.58 88.39,46.99 111,46.99 112.27,45.72 112.27,24.38 111.25,23.37 105.41,23.37 104.14,24.64 U6.2
DSCLM_1
  Top 0.305: 52.32,103.43 R36.1 52.36,103.29 52.48,103.41 U11.6 55.2,109.74 J4.DSCLM(5) | 52.32,103.43 52.32,104.68 R35.2 | 52.34,103.41 52.32,103.43
DSCLM_2
  Top 0.305: R44.2 68.83,104.68 R46.1 69.06,103.41 U12.6 71.71,109.74 J8.DSCLM(5)
DSCLP_1
  Top 0.305: R34.1 R36.2 53.6,102.91 U11.7 56.38,102.91 56.52,103.05 J4.DSCLP(4)
DSCLP_2
  Top 0.305: R45.1 R46.2 70.1,102.91 U12.7 72.64,102.91 73.03,103.3 J8.DSCLP(4)
DSDAM_1
  Top 0.305: R32.2 53.85,98.59 | 53.85,98.59 54.32,98.59 R31.1 | 53.85,98.59 53.85,101.4 54.36,101.91 U11.9 56.89,101.91 58.42,103.44 58.42,106.6 J4.DSDAM(2)
DSDAM_2
  Top 0.305: R42.1 70.36,98.6 | 70.36,98.6 70.36,101.65 70.62,101.91 U12.9 73.4,101.91 | 70.36,98.6 68.85,98.6 R47.2 | 73.4,101.91 73.41,101.91 | 73.4,101.91 74.93,103.44 74.93,106.6 J8.DSDAM(2)
DSDAP_1
  Top 0.305: R32.1 R33.2 | 52.32,100.21 R32.1 | R32.1 52.85,100.14 53.18,100.48 53.18,101.49 54.1,102.41 U11.8 56.64,102.41 57.72,103.49 57.72,107.81 59.69,109.78 J4.DSDAP(1)
DSDAP_3
  Top 0.305: R43.2 R47.1 69.36,100.14 69.85,100.64 69.85,101.91 70.36,102.41 U12.8 72.9,102.41 74.23,103.75 74.23,107.61 75.06,108.45 75.5,108.45 J8.DSDAP(1)
GND  (via drill 0.35)
  Top 0.254: 30.83,51.76 R59.1
  Top 0.305: U10.25 48.02,58.3 v48.31,58.6 | U7.14 78.7,52.79 v78.92,52.58 | U11.5 60.94,103.41 | 60.94,103.41 60.96,103.43 | 60.94,103.41 61.45,103.41 v61.72,103.68 | U12.5 77.2,103.41 77.47,103.68 v77.47,104.44
  Top 0.559: SJ_A17.1 v110.74,55.37 | D4.C 86.93,98.09 v87.88,98.09 | U9.7 U9.8
  Bottom 0.406: J4.GND(3) 57.78,105.33 57.66,105.21
  other vias: 41.02,96.67 54.53,50.29 68.33,49.23 52.12,58.6 70.87,80.52 59.18,69.6 19.81,23.62 35.05,24.38 51.05,23.88 66.55,24.13 84.33,24.38 101.09,24.89 13.46,58.93 8.13,51.56 81.53,57.15 92.2,60.2 118.87,33.78 118.11,74.3 47.24,61.98 39.93,50.72 42.72,50.72 51.99,46.48 74.6,46.48 58.42,1.78 93.98,1.78 15.75,100.38 100.84,74.42 118.62,84.58 55.88,118.16 52.32,96.82 102.11,83.31 111.25,80.52 86.87,80.26 87.63,80.26 86.87,79.5 87.63,79.5 86.11,80.26 86.11,79.5 87.63,85.09 87.63,85.85 86.87,85.09 86.11,85.09 86.87,85.85 86.11,85.85 91.44,82.3 90.17,88.39 91.44,83.31 64.26,118.16 90.17,76.45 72.39,117.4 64.01,108 80.77,118.16 72.9,100.13 49.53,104.19 106.17,73.41 106.17,72.64 106.93,72.64 106.93,73.41 106.17,71.88 106.93,71.88 79.5,98.35 76.96,97.08 58.93,97.59 51.05,110.29 99.82,83.31 67.06,108.76 57.4,114.35 49.02,109.27 88.39,123.19 88.39,121.92 88.39,120.65 88.39,119.38 88.39,118.11 88.39,116.84 87.12,116.84 87.12,118.11 87.12,119.38 87.12,120.65 87.12,121.92 87.12,123.19 108.71,123.19 108.71,121.92 108.71,120.65 108.71,119.38 108.71,118.11 108.71,116.84 109.98,116.84 109.98,118.11 109.98,119.38 109.98,120.65 109.98,121.92 109.98,123.19 28.83,102.51 21.08,105.97 28.96,110.79 39.88,112.06 28.7,96.27 45.97,111 70.36,104.7 80.52,108.51 62.99,58.93 42.72,57.33 55.55,55.88 76.89,57.4 89.15,57.4 113.73,9.84 9.33,5.52 36.64,1.71 20.76,18.22 53.78,17.91 86.8,17.91 49.28,71.25 25.91,78.11 80.26,82.55 73.91,92.51 87.63,65.28 94.74,81.79 95.76,95.81 70.54,57.91 70.54,59.44 64.77,92 75.69,65.02 55.55,55.88 91.69,46.99 95.5,51.05 95.5,46.99 69.85,65.53 119.13,59.69 111.76,64.77 52.83,88.44 31.24,91.95 42.04,101.75 46.48,94.54 68.83,85.65 84.58,96.06 102.11,92 83.31,73.91 100.84,64.77 33.4,99.47 19.81,118.67 35.05,118.67 43.81,111.66
  pour Top (isolate 0.406, rank 3): 0,0 123.19,0 123.19,125.73 0,125.73
  pour Bottom (isolate 0.406, rank 3): 0,0 123.19,0 124.46,125.73 1.27,125.73
  pour Top (isolate 0.305, rank 2): 82.55,66.04 82.55,90.17 57.15,90.17 57.15,66.04
  pour Bottom (isolate 0.305): 57.15,90.17 57.15,66.04 82.55,66.04 82.55,90.17
  pour Top (isolate 0.406, rank 3): 83.82,74.93 96.52,74.93 96.52,90.17 83.82,90.17
  pour Top (isolate 0.305): 45.72,129.54 45.72,93.98 82.55,93.98 82.55,129.54
  pour Bottom (isolate 0.406): 45.72,93.98 82.55,93.98 82.55,129.54 45.72,129.54
  pour Top (isolate 0.305, rank 2): 97.79,66.04 97.79,90.17 113.03,90.17 113.03,66.04
  pour Bottom (isolate 0.406, rank 2): 113.03,66.04 113.03,90.17 97.79,90.17 97.79,66.04
  pour Bottom (isolate 0.406): 83.82,74.93 83.82,90.17 96.52,90.17 96.52,74.93
  pour Top (isolate 0.305, rank 2): 83.82,93.98 83.82,129.54 113.03,129.54 113.03,93.98
  pour Bottom (isolate 0.406, rank 2): 83.82,129.54 113.03,129.54 113.03,93.98 83.82,93.98
  pour Top (isolate 0.305): 55.88,90.17 10.16,90.17 10.16,66.04 55.88,66.04
  pour Bottom (isolate 0.305): 55.88,90.17 55.88,66.04 10.16,66.04 10.16,90.17
N$1
  Top 0.559: R39.1 101.87,81.76 D1.A
N$2
  Top 0.305: R40.1 D5.A
N$3
  Top 0.305: D6.A 89.43,86.09 89.43,80.23 87.36,78.16 R41.1 87.49,77.22
N$4
  Top 0.559: D4.A 86.9,96.5 R11.1
N$6
  Top 0.559: U15.1 48.39,87 48.77,87.38 R16.2
N$23
  Top 0.305: U8.26 69.47,76.33 69.09,76.71 69.09,80.16 72.49,83.57 76.45,83.57 76.87,83.15 C22.1
OE
  Top 0.305: U10.23 49.32,58.73 R15.1
PWM1
  Top 0.305: U10.12 53.22,49.72 49.98,46.48 14.22,46.48 11.43,43.69 11.43,24.89 12.95,23.37 18.03,23.37 19.05,24.38 U1.3
PWM2
  Top 0.305: U10.11 52.57,49.93 49.73,47.09 13.82,47.09 10.72,43.99 10.72,24.59 11.18,24.13 11.19,24.13 12.66,22.66 27.74,22.66 U2.3
PWM3
  Top 0.305: U10.10 51.92,50.14 49.48,47.7 13.56,47.7 10.01,44.14 10.01,24.29 12.46,21.84 43.43,21.84 U3.3
PWM4
  Top 0.305: U10.9 51.27,50.37 49.21,48.31 13.31,48.31 9.3,44.3 9.3,24 12.16,21.13 59.23,21.13 U4.3
PWM5
  Top 0.305: U10.8 50.62,50.58 49.06,49.02 13.16,49.02 8.59,44.45 8.59,23.7 11.87,20.42 75.03,20.42 U5.3
PWM6
  Top 0.305: U10.7 49.97,50.79 48.8,49.63 12.91,49.63 7.98,44.7 7.98,23.51 7.87,23.41 11.57,19.71 90.83,19.71 U6.3
SCB1_RX[0]_SCL[0]
  Top 0.305: R3.1 61.98,80.21 60.5,78.74 60.5,72.08 61.46,71.13 U8.11 64.27,71.13 65.38,72.24 65.38,81.89 66.29,82.8 R2.1
SCB1_TX[0]_SDA[0]
  Top 0.305: R5.1 60.71,79.8 59.89,78.99 59.89,71.68 61.09,70.48 U8.12 64.64,70.48 65.99,71.83 65.99,81.38 67.56,82.96 R4.1
SCL  (via drill 0.35)  (1 unrouted)
  Top 0.305: 59.18,60.35 48.9,60.35 47.37,58.82 U10.26 | v59.18,61.72 TP16.1 61.06,64.62 | v59.18,59.44 59.18,60.35 | U8.15 69,69.18 66.6,71.58 66.6,81.13 72.34,86.87 R10.2 74.68,86.88 TP24.1 | U7.16 78.22,54.09 78.74,54.61 78.74,60.35 | U15.14 26.29,73.41 v54.1,73.41 TP66.1 56.39,72.14 56.39,69.09 60.86,64.62 61.06,64.62 | J7.SCL 91.44,62.99 88.8,60.35 78.74,60.35 | 59.18,60.35 78.74,60.35 | 61.06,64.62 70.71,64.62 TP6.1 71.63,67.82 70.87,68.58 70.87,69.09
  Bottom 0.305: v59.18,61.72 v59.18,59.44
SCL_IN  (via drill 0.35)
  Top 0.305: 65.79,98.35 65.53,98.6 65.53,101.39 64.14,102.79 | 64.14,102.79 v64.14,103.42 v64.14,103.43 | v64.14,98.67 63.44,97.97 R38.1 | 65.79,98.35 | 65.79,98.35 66.55,97.59 73.15,97.59 73.91,98.35 73.91,101.55 75.28,102.91 U12.4 81.54,102.91 TP52.1 | 64.14,102.79 64.02,102.91 U11.4 58.77,102.91 57.15,101.3 TP45.1 57.15,94.49 57.76,93.88 64.87,93.88 66.29,92.46 TP26.1 66.29,87.63 | R2.2 66.29,87.63 | R10.1 76.22,87.87 v76.2,87.88 | v65.53,87.63 66.29,87.63
  Bottom 0.305: v64.14,103.43 v64.14,98.67 | v76.2,87.88 75.95,87.63 v65.53,87.63
SDA  (via drill 0.35)
  Top 0.305: 60.2,60.96 48.64,60.96 46.72,59.03 U10.27 | 60.2,60.96 TP15.1 61.47,64.01 62.74,64.01 | 77.98,53.46 77.96,53.44 U7.15 78.43,53.44 79.5,54.51 v79.5,59.59 | U15.13 24.51,74.17 TP69.1 55.22,74.06 55.39,74.06 57,72.46 57,69.34 60.96,65.38 v62.74,65.38 | TP18.1 75.69,89.15 76.2,88.65 76.71,88.65 77.71,87.65 R12.2 77.71,85.84 77.27,85.39 71.73,85.39 67.21,80.88 67.21,71.98 69.36,69.83 U8.16 71.39,69.83 72.39,68.83 TP5.1 72.39,65.02 71.37,64.01 62.74,64.01 | J7.SDA 88.9,62.99 86.87,60.96 79.5,60.96 | 60.2,60.96 79.5,60.96 | v79.5,61.72 79.5,60.96 | v62.74,62.99 62.74,64.01
  Bottom 0.305: v79.5,59.59 v79.5,61.72 | v62.74,65.38 v62.74,62.99
SDA_IN  (via drill 0.35)
  Top 0.305: 62.48,101.91 64.15,101.91 64.92,101.14 64.92,98.35 66.3,96.98 73.41,96.98 74.52,98.1 74.52,101.3 75.14,101.91 U12.2 81.53,101.91 TP53.1 | R37.1 62.5,101.9 62.48,101.91 | 62.48,101.91 U11.2 58.68,101.91 57.91,101.14 TP44.1 58.17,94.49 65.12,94.49 67.56,92.05 TP25.1 67.56,88.65 | R4.2 67.56,88.65 | R12.1 79.25,86.88 v79.25,87.88 | v68.33,88.65 67.56,88.65
  Bottom 0.305: v79.25,87.88 78.49,88.65 v68.33,88.65
SWD_CLK[0]  (via drill 0.35)
  Top 0.305: U8.14 64.93,69.18 66.29,67.82 v70.36,67.82
  Bottom 0.305: v70.36,67.82 77.22,67.82 78.49,69.09 78.49,70.87 77.47,71.88 J1.2
SWD_IO[0]  (via drill 0.35)
  Top 0.305: U8.13 66.02,69.83 v66.04,69.85
  Bottom 0.305: J1.1 66.55,69.34 v66.04,69.85
UART_!RE!  (via drill 0.35)
  Top 0.305: U8.10 61.67,71.78 61.11,72.34 61.11,78.48 62.83,80.2 62.83,86.52 61.98,87.38 TP21.1 56.49,87.38 52.58,91.29 34.8,91.29 34.42,91.67 v34.42,92.58 TP30.1 U9.4 | U15.7 TP3.1 v32.51,90.68
  Bottom 0.305: v32.51,90.68 v34.42,92.58
UART_DE  (via drill 0.35)
  Top 0.305: U8.9 62.19,72.43 61.72,72.9 61.72,78.23 63.44,79.95 63.44,86.77 62.08,88.14 TP22.1 56.59,88.14 52.83,91.9 36.07,91.9 35.69,92.28 v35.69,92.58 TP31.1 U9.5 | TP4.1 U15.8
  Bottom 0.305: U15.8 35.56,92.58 v35.69,92.58
UART_RX
  Top 0.305: U15.4 TP72.1 40.13,90.68 | U9.3 TP29.1 33.15,91.31 33.78,90.68 40.13,90.68 | 40.13,90.68 52.32,90.68 56.39,86.61 TP20.1 61.47,86.61 61.98,86.11 R3.2
UART_TX  (via drill 0.35)
  Top 0.305: 37.08,96.69 U9.6 TP28.1 36.96,92.89 37.34,92.51 41.91,92.51 | U15.3 TP71.1 42.16,89.92 v41.91,89.92 | 41.91,92.51 53.29,92.51 55.37,90.42 55.38,90.42 v56.64,89.16 | v41.91,93.22 41.91,92.51 | R5.2 59.93,85.36 59.44,85.85 TP11.1 v56.64,85.85
  Bottom 0.305: v41.91,89.92 v41.91,93.22 | v56.64,85.85 v56.64,89.15 v56.64,89.16
USBM
  Top 0.305: TP47.1 48.77,104.57 J4.USBM(8)
  Bottom 0.305: J8.USBM(8) 66.35,107.24 58.23,115.36 56.13,115.36 54.73,113.97 54.73,110.99 54.04,110.29 54.04,109.4 51.87,107.24 J4.USBM(8)
USBP
  Top 0.305: TP46.1 48.01,105.72 52.07,109.78 J4.USBP(7)
  Bottom 0.305: J4.USBP(7) 53.22,110.29 53.22,111.62 54.12,112.53 54.12,114.22 55.88,115.97 58.48,115.97 64.67,109.78 J8.USBP(7)
VIN1  (via drill 0.35)
  Bottom 0.559: SJ2.1 v25.15,35.05
  pour Top (isolate 0.406): 20.95,25.4 20.95,38.1 28.57,38.1 28.57,25.4
VIN2  (via drill 0.35)
  Bottom 0.559: SJ5.1 v41.4,35.05
  pour Top (isolate 0.406): 37.47,25.4 37.47,38.1 45.09,38.1 45.09,25.4
VIN3  (via drill 0.35)
  Bottom 0.559: SJ7.1 v57.91,35.05
  pour Top (isolate 0.406): 53.98,25.4 53.98,38.1 61.59,38.1 61.59,25.4
VIN4  (via drill 0.35)
  Bottom 0.559: SJ8.1 v74.42,35.05
  pour Top (isolate 0.406): 70.48,25.4 70.48,38.1 78.11,38.1 78.11,25.4
VIN5  (via drill 0.35)
  Bottom 0.559: v90.93,35.05 SJ9.1
  pour Top (isolate 0.406): 87,25.4 87,38.1 94.61,38.1 94.61,25.4
VIN6  (via drill 0.35)
  Bottom 0.559: v107.44,35.05 SJ10.1
  pour Top (isolate 0.406): 103.5,25.4 103.5,38.1 111.76,38.1 111.76,25.4
XRES
  Top 0.305: J1.3 73.66,74.42 72.4,75.68 U8.25

## Text on the board
tPlace: EDGE | EDGE | EDGE | GND | GND | GND | 3V3 | 3V3 | 3V3 | GND | 5V | 5V | 24V | 24V | GND | GND | NC | SCL-IN | SDA-IN | 5A Fuse | 24V | USBP | 3V3 | SCL-IN | GND | 24V | RS485 | USBM | SDA-IN | NC | RS485 Connection Pair w/UART Transceiver | RJ45 Connector Pair w/dI2C Buffer + LED | Barrel Jack Connector w/24V Conditioning + Fuse + LED | PSOC4100 MCU w/I2C or RS485 | Particle Photon w/I2C + RS485 + 5V Enable | SCL-IN | SCL | IO | 5-to-3V3@400mA Lin Reg | 24-to-5V@1A Switching Reg | 24V | DE | RE | RX | TX | 5V | RS485 | SDA-IN | SDA | 3V3 | I2C / Conn | 3.3V | NC | 5V / EN | RS485 / Enable | I2C / Enable | GND | GND | GND | GND | Programming Header | 5V | 3.3V | GND | SDA | GND | GND | GND | SCL | I2C Header | 5V | 3V3 | PSOC4100: 32-bit 24MHz / ARM-M0 Microcontroller | NC | I2C | IO | 6-Channel 24V@700mA Current Regulator w/I2C Controlled Dimming via PWM or Analog Signaling | GND | LDAC | CLR | SCL | SDA | 3.3V | IO | GND | PCA9685 Address Set | DAC5578 Address Set | 24V | 1+ | A5 | A4 | A3 | A2 | A1 | A0 | +RW | Default | Drives x6 channels of LEDs by regulating the current up to 700mA (per channel) at 24V. Communicates via / differential-I2C (dI2C) or RS485 (See enables on PSOC module). To communicate directly with the board ICs / and avoid programming the PSOC, enable I2C Connect. Current regulators can be driven by either dimming / or PWM control. Allows for daisy chaining comms between multiple boards. | 0x4c | 0x4a | 0x48 | LDAC / HW-EN | PCA9685: 16-Channel, / 12-bit FM+ I2C PWM Driver | DAC5578: 8-Channel, / 8-bit I2C DAC | Changelog / - replaced 24v-to-5v regulator with R78E5 / - added dual i2c buffers / - updated to style conventions v1.0 | GND | CH1 | CH2 | CH3 | CH4 | CH5 | CH6 | EDGE
bPlace: CH1 | CH2 | CH3 | CH4 | CH5 | CH6